# Altium schematic sheet exercise2.SchDoc
size A4
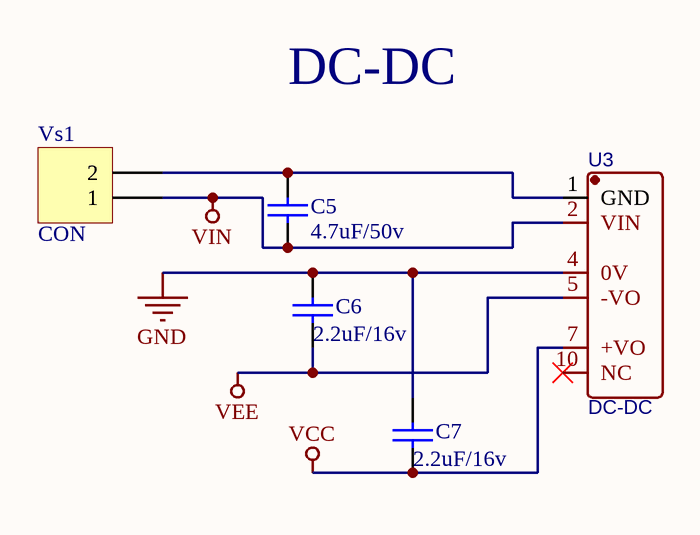
[diagram p0: exercise2.SchDoc]

## Parts
C5  value 4.7uF/50v  [RAD-0.3]  (hidden comment: Cap)
C6  value 2.2uF/16v  [RAD-0.3]  (hidden comment: Cap)
C7  value 2.2uF/16v  [RAD-0.3]  (hidden comment: Cap)
U3  DC-DC  [DC-DC]
Vs1  CON  [HDR1X2]

## Nets
GND: C6.2 C7.2 U3.4(0V)
VCC: C7.1 U3.7(+VO)
VEE: C6.1 U3.5(-VO)
VIN: C5.1 U3.2(VIN) Vs1.1
NetC5_2: C5.2 U3.1(GND) Vs1.2

Not connected (* = marked no-connect by the designer): U3 10(NC)*

## Notes on the sheet
- DC-DC

## Library data of the parts
C5-C7 = Cap: Capacitor; Published: 8-Jun-2000; LatestRevisionDate: 17-Jul-2002; LatestRevisionNote: Re-released for DXP Platform.; PackageReference: RAD-0.3; Publisher: Altium Limited; PackageDescription: Radial Cap, Thru-Hole; 2 Leads; 0.3 in Pin Spacing
U3 = DC-DC: BOM_Manufacturer: MORNSUN; BOM_Manufacturer Part: A0515XT-1WR2; BOM_Supplier: LCSC; BOM_Supplier Part: C58972; spicePre: U; spiceSymbolName: A0515XT-1WR2
Vs1 = Header 2: Header, 2-Pin; LatestRevisionDate: 17-Jul-2002; LatestRevisionNote: Re-released for DXP Platform.; Publisher: Altium Limited